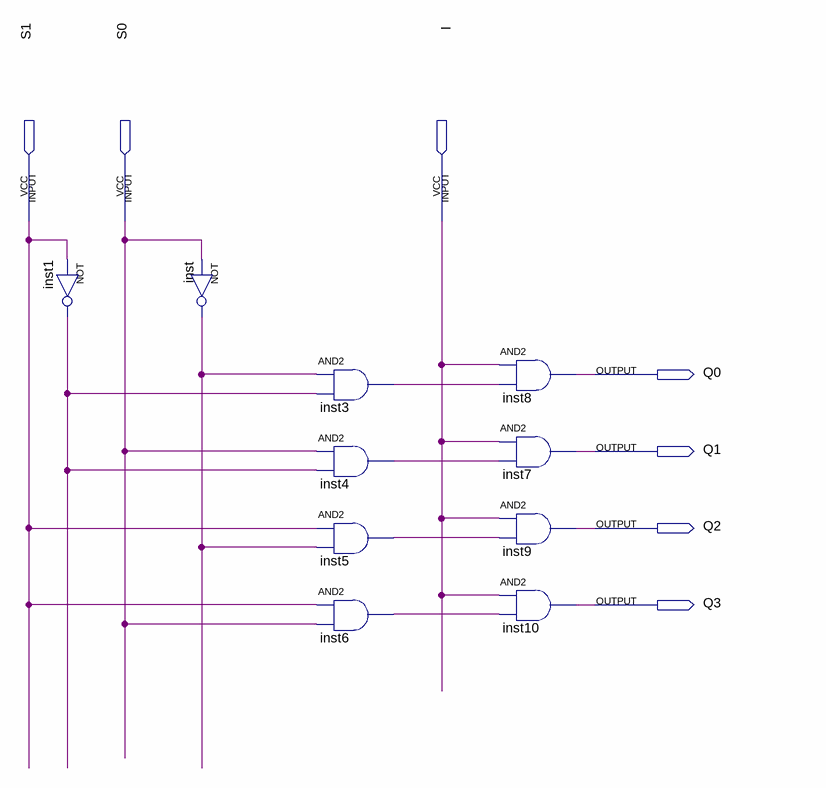
[diagram p0: schematic sheet]
// Quartus schematic DataDistributor.bdf as structural Verilog: 10 symbols, 7 pins
module DataDistributor (
  input  S1,
  input  S0,
  input  I,
  output Q0,
  output Q1,
  output Q2,
  output Q3
);

  wire inst1_out, inst3_out, inst4_out, inst5_out, inst6_out, inst_out;

  not inst1 (inst1_out, S1);
  not inst (inst_out, S0);
  and inst3 (inst3_out, inst_out, inst1_out);
  and inst4 (inst4_out, S0, inst1_out);
  and inst5 (inst5_out, S1, inst_out);
  and inst6 (inst6_out, S1, S0);
  and inst8 (Q0, I, inst3_out);
  and inst7 (Q1, I, inst4_out);
  and inst9 (Q2, I, inst5_out);
  and inst10 (Q3, I, inst6_out);
endmodule
